# Altium project USB_Hub.PrjPcb
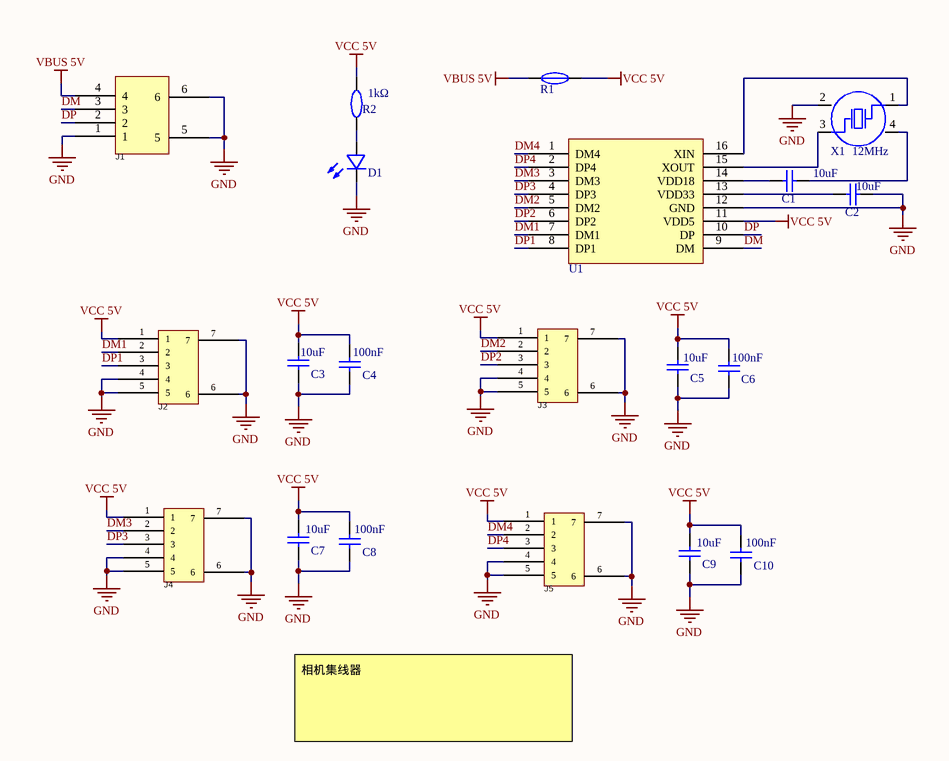
[diagram p0: USB_Hub.SchDoc]
1 sheet, 20 parts. Net scope: global (net labels, ports and power ports of the same name join across sheets).
Board files: USB_Hub_V1.PcbDoc, USB_Hub_V2.PcbDoc

## Sheet USB_Hub.SchDoc
size A4

### Parts
C1  CAP0805  [C0805]  (value not drawn)
C2  CAP0805  [C0805]  (value not drawn)
C3  CAP0805  [C0805]  (value not drawn)
C4  CAP0805  [C0805]  (value not drawn)
C5  CAP0805  [C0805]  (value not drawn)
C6  CAP0805  [C0805]  (value not drawn)
C7  CAP0805  [C0805]  (value not drawn)
C8  CAP0805  [C0805]  (value not drawn)
C9  CAP0805  [C0805]  (value not drawn)
C10  CAP0805  [C0805]  (value not drawn)
D1  LED0805-RD  [LED0805-RD]  (value not drawn)
J1  AFC01-S04FCC-00  [FFC-SMD_4P-P0.50_AFC01-S04FCC-00]  (value not drawn)
J2  WAFER-SH1.0-5PWB  [CONN-SMD_5P-P1.00_XUNPU_WAFER-SH1.0-5PWB]  (value not drawn)
J3  WAFER-SH1.0-5PWB  [CONN-SMD_5P-P1.00_XUNPU_WAFER-SH1.0-5PWB]  (value not drawn)
J4  WAFER-SH1.0-5PWB  [CONN-SMD_5P-P1.00_XUNPU_WAFER-SH1.0-5PWB]  (value not drawn)
J5  WAFER-SH1.0-5PWB  [CONN-SMD_5P-P1.00_XUNPU_WAFER-SH1.0-5PWB]  (value not drawn)
R1  TLC F1206  [F1206]  (value not drawn)
R2  RES0805  [R0805]  (value not drawn)
U1  SL2.1A  [SOP-16_L10.0-W3.9-P1.27-LS6.0-BL]  (value not drawn)
X1  OSC CRYSTAL-SMD_4P-L3.2-W2.5-BL  [CRYSTAL-SMD_4P-L3.2-W2.5-BL]  (value not drawn)

### Nets
GND: C2.2 C3.1 C4.1 C5.1 C6.1 C7.1 C8.1 C9.1 C10.1 D1.1(-) J1.1 J1.5 J1.6 J2.4 J2.5 J2.6 J2.7 J3.4 J3.5 J3.6 J3.7 J4.4 J4.5 J4.6 J4.7 J5.4 J5.5 J5.6 J5.7 U1.12(GND) X1.2(GND)
VBUS 5V: J1.4 R1.1
VCC 5V: C3.2 C4.2 C5.2 C6.2 C7.2 C8.2 C9.2 C10.2 J2.1 J3.1 J4.1 J5.1 R1.2 R2.2 U1.11(VDD5)
DM: J1.3 U1.9(DM)
DM1: J2.2 U1.7(DM1)
DM2: J3.2 U1.5(DM2)
DM3: J4.2 U1.3(DM3)
DM4: J5.2 U1.1(DM4)
DP: J1.2 U1.10(DP)
DP1: J2.3 U1.8(DP1)
DP2: J3.3 U1.6(DP2)
DP3: J4.3 U1.4(DP3)
DP4: J5.3 U1.2(DP4)
NetC1_1: C1.1 U1.14(VDD18)
NetC1_2: C1.2 X1.4(GND)
NetC2_1: C2.1 U1.13(VDD33)
NetD1_2: D1.2(+) R2.1
NetU1_15: U1.15(XOUT) X1.3(OSC2)
NetU1_16: U1.16(XIN) X1.1(OSC1)

### Notes on the sheet
- (near R2) 1kΩ
- (near X1) 12MHz
- 10uF
- (near C2) 10uF
- (near C3) 10uF
- (near C4) 100nF
- (near C5) 10uF
- (near C6) 100nF
- (near C7) 10uF
- (near C8) 100nF
- (near C9) 10uF
- (near C10) 100nF
- 相机集线器

### Library data of the parts
C1-C10 = CAP0805: 0805贴片电容; Manufacturer: SAMSUNG(三星); Symbol: CL21B104KBCNNNC; Add into BOM: yes; Tolerance: ±10%; Voltage Rated: 50V; Temperature Coefficient: X7R; Device: CL21B104KBCNNNC; LCSC Part Name: 100nF ±10% 50V; Supplier Part: C1711; Manufacturer Part: CL21B104KBCNNNC; Supplier Footprint: 0805; JLCPCB Part Class: Extended Part; Datasheet: https://atta.szlcsc.com/upload/public/pdf/source/20160103/1457707693305.pdf; Supplier: LCSC; Convert to PCB: yes
D1 = LED0805-RD: 蓝光LED; Manufacturer: MEIHUA(美华科技); Symbol: MHT170UBCT; Add into BOM: yes; Lens Color: 无色透明; Dominant Wavelength: 460nm~475nm; Peak Wavelength: 468nm; Forward Current: 20mA; Forward Voltage (VF): 3.3V; Luminous Intensity: 225mcd; Power Dissipation: 95mW; Viewing Angle: 140°; Device: MHT170UBCT; LCSC Part Name: LED贴片0805超高亮蓝光; Supplier Part: C389525; Manufacturer Part: MHT170UBCT; Supplier Footprint: 0805; JLCPCB Part Class: Extended Part; Datasheet: https://atta.szlcsc.com/upload/public/pdf/source/20190515/C389525_9DDE5770D44EFFE682D3E1E38A61D6F4.pdf; Supplier: LCSC; Convert to PCB: yes; Diode Configuration: -; Color Temperature: -; Luminous Flux (@25℃): -; Mounting Sytle: -; Operating Temperature: -40~+85
J1 = FPC AFC01-S04FCC-00: 4pin FPC接口; Manufacturer: JS(钜硕电子); Add into BOM: yes; Locking Feature: 翻盖式; Number of Contacts: 4P; Pitch: 0.5mm; FFC, FCB Thickness: 0.3mm; Symbol: AFC01-S04FCC-00; Device: AFC01-S04FCC-00; LCSC Part Name: 间距:0.5mm P数:4P 翻盖式 下接; Supplier Part: C262260; Manufacturer Part: AFC01-S04FCC-00; Supplier Footprint: SMD,P=0.5mm,卧贴; JLCPCB Part Class: Extended Part; Datasheet: https://atta.szlcsc.com/upload/public/pdf/source/20190816/C413942_2A72D1AC756EAE17EEDF756A339D4500.pdf; Supplier: LCSC; Convert to PCB: yes; Contact Type: 下接; Mounting Type: 卧贴; Height Above Board: 2mm
J2-J5 = SH1.0-5pin: SH1.0 5pin 母头端子; Manufacturer: XUNPU(讯普); Add into BOM: yes; Pins Structure: 1x5P; Pitch: 1mm; Number of PINs Per Row: 5; Current Rating (Max): 1A; Symbol: WAFER-SH1.0-5PWB; Device: WAFER-SH1.0-5PWB; LCSC Part Name: 1x5P 间距:1mm 卧贴; Supplier Part: C3029344; Manufacturer Part: WAFER-SH1.0-5PWB; Supplier Footprint: SMD,P=1mm,卧贴; JLCPCB Part Class: Extended Part; Datasheet: https://atta.szlcsc.com/upload/public/pdf/source/20220527/1879B8210BD3B2006BCEAC1A40D397B6.pdf; Supplier: LCSC; Convert to PCB: yes; Mounting Style: 卧贴; Number of Pins: 5P; Number of Rows: 1; Operating Temperature Range: -25℃~+85℃
R1 = TLC F1206: 保险丝; Manufacturer: TLC(竞沃); Symbol: TLC-NSMD100; Add into BOM: yes; Operating Voltage (Max): 6V; Current Rating (Max): 100A; Hold Current: 1A; Trip Current: 2A; Power Dissipation: 600mW; Maximum Time to Trip: 100ms; Device: TLC-NSMD100; LCSC Part Name: 6V 1A 自恢复; Supplier Part: C261954; Manufacturer Part: TLC-NSMD100; Supplier Footprint: 1206; JLCPCB Part Class: Extended Part; Datasheet: https://atta.szlcsc.com/upload/public/pdf/source/20180802/C261954_CE31CE21EEB143DB51778C363DF0F083.pdf; Supplier: LCSC; Convert to PCB: yes; Resistance - Initial (Ri) (Min): -; Resistance - Post Trip (R1) (Max): -; Operating Temperature: -40~+85
R2 = RES0805: 0805贴片电阻; Manufacturer: FH(风华); Symbol: RS-05K102JT; Add into BOM: yes; Tolerance: ±5%; Power(Watts): 125mW; Temperature Coefficient: ±100ppm/; Overload Voltage (Max): 150V; Device: RS-05K102JT; LCSC Part Name: 1kΩ ±5%; Supplier Part: C115302; Manufacturer Part: RS-05K102JT; Supplier Footprint: 0805; JLCPCB Part Class: Extended Part; Datasheet: https://atta.szlcsc.com/upload/public/pdf/source/20170704/1499151304704.pdf; Supplier: LCSC; Convert to PCB: yes; Operating Temperature Range: -55~+155
U1 = SL2.1A: USB 2.0接口4口HUB芯片; Manufacturer: CoreChips(和芯润德); Add into BOM: yes; Symbol: SL2.1A; Device: SL2.1A; LCSC Part Name: SL2.1A; Supplier Part: C192893; Manufacturer Part: SL2.1A; Supplier Footprint: SOP-16_150mil; JLCPCB Part Class: Extended Part; Datasheet: https://atta.szlcsc.com/upload/public/pdf/source/20180522/C192893_624110D24898D57AAC785E3DF98EA862.pdf; Supplier: LCSC; Convert to PCB: yes; Type: -; Protocol: -; Number of Drivers/Receivers: -; Data Rate: -; Supply Voltage: -
X1 = OSC CRYSTAL-SMD_4P-L3.2-W2.5-BL: 晶振; Manufacturer: JGHC(晶光华); Symbol: S3212000201080; Add into BOM: yes; Crystal Type: 贴片无源晶振; Frequency Tolerance: ±10ppm; Load Capacitance: 20pF; Equivalent Series Resistance (ESR): 80Ω; Device: S3212000201080; LCSC Part Name: 12MHz ±10ppm 20pF; Supplier Part: C426972; Manufacturer Part: S3212000201080; Supplier Footprint: SMD3225-4P; JLCPCB Part Class: Extended Part; Datasheet: https://atta.szlcsc.com/upload/public/pdf/source/20191012/C426972_E2C41F8C78BF72E52773F7737EA32F83.pdf; Supplier: LCSC; Convert to PCB: yes; Frequency Stability: -; Operating Temperature: -40~+85